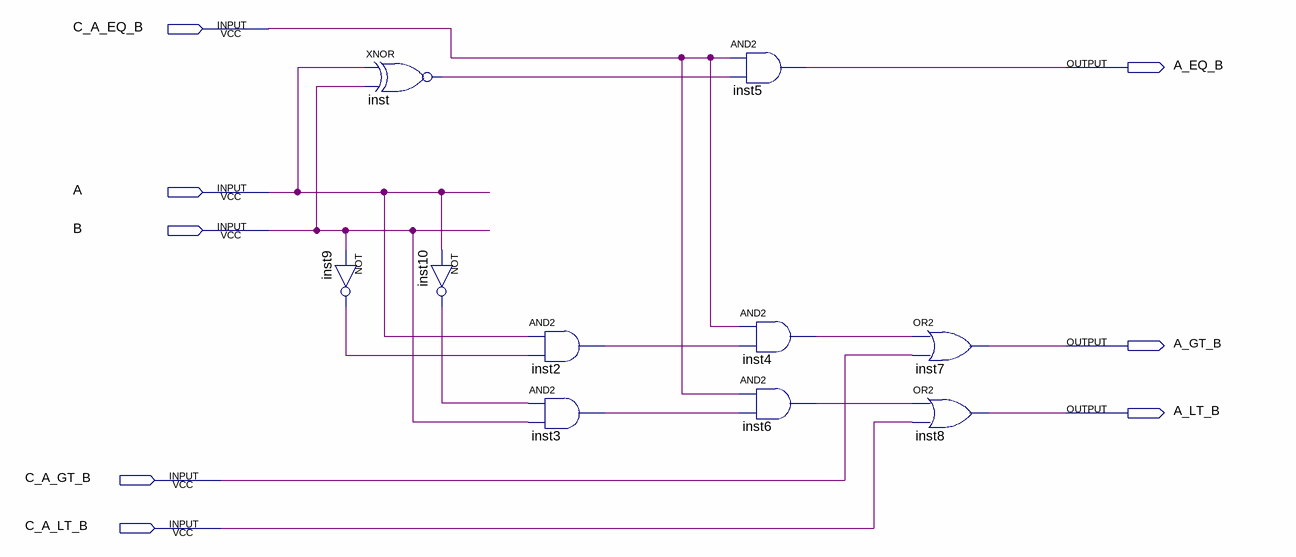
[diagram p0: schematic sheet]
// Quartus schematic commencer.bdf as structural Verilog: 10 symbols, 8 pins
module commencer (
  input  C_A_EQ_B,
  input  A,
  input  B,
  input  C_A_GT_B,
  input  C_A_LT_B,
  output A_EQ_B,
  output A_GT_B,
  output A_LT_B
);

  wire inst2_out, inst3_out, inst4_out, inst6_out, inst9_out, inst10_out, inst_out;

  xnor inst (inst_out, A, B);
  not inst9 (inst9_out, B);
  not inst10 (inst10_out, A);
  and inst2 (inst2_out, A, inst9_out);
  and inst3 (inst3_out, inst10_out, B);
  and inst5 (A_EQ_B, C_A_EQ_B, inst_out);
  and inst4 (inst4_out, C_A_EQ_B, inst2_out);
  and inst6 (inst6_out, C_A_EQ_B, inst3_out);
  or inst7 (A_GT_B, inst4_out, C_A_GT_B);
  or inst8 (A_LT_B, inst6_out, C_A_LT_B);
endmodule
